# EasyEDA Pro project OMO - WayBox.eprj, board PCB2
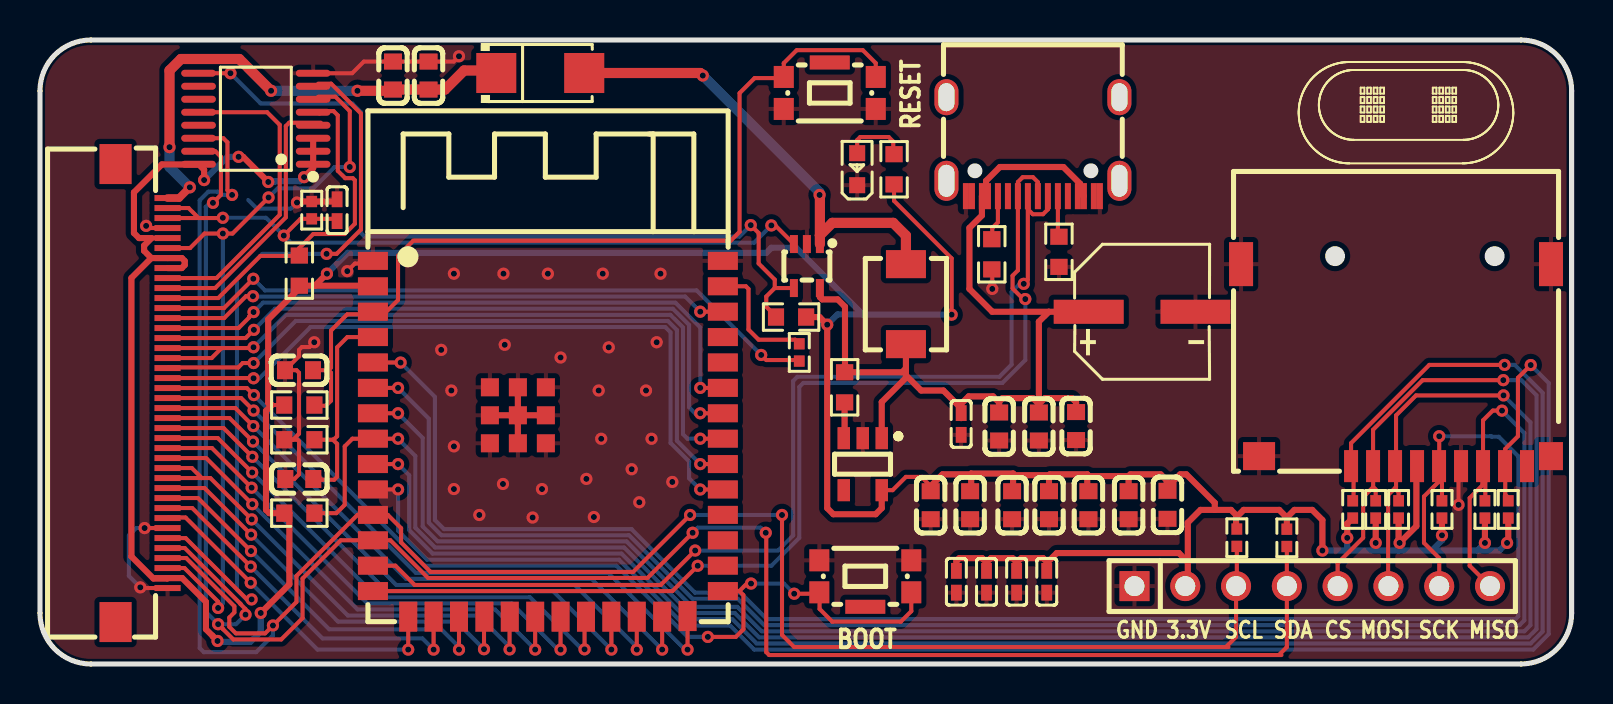
[diagram p4: board, top side]
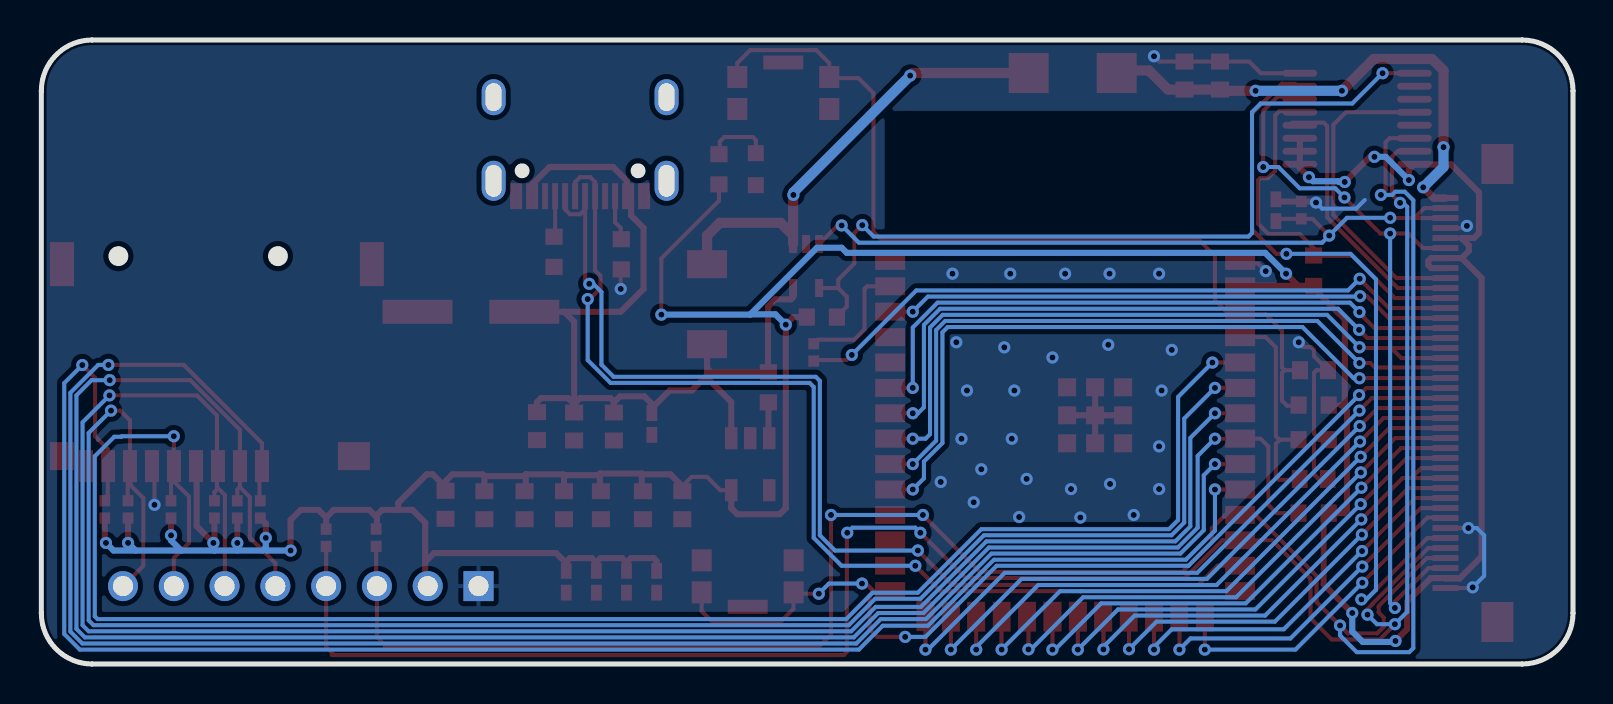
[diagram p5: board, bottom side, seen from below]

Outline 76.6 x 31.2 mm; copper layers: Top Layer, Bottom Layer. Coordinates in mm from the lower left corner of the outline.
Outline path: 0,28.66 0,2.54 arc(0.74,0.74) 2.54,0 74.06,0 arc(75.86,0.74) 76.6,2.54 76.6,28.66 arc(75.86,30.46) 74.06,31.2 2.54,31.2 arc(0.74,30.46) 0,28.66
Stack: Top Layer 0.035mm / Dielectric1 1.51mm FR4 er 4.5 / Bottom Layer 0.035mm

## Design rules (mm)
template: JLCPCB Capability(Two Layers Board)
spacing copperThickness1oz (default): track to track 0.102, other pairs 0.152 to 0.3
spacing copperThickness2oz: track to track 0.203, other pairs 0.152 to 0.3
track width copperThickness1oz (default): min 0.127, default 0.254, max 2.54
track width copperThickness2oz: min 0.203, default 0.254, max 2.54
differential pair differentialPair (default): width min 0.127, default 0.254, max 2.54; gap min 0.152, default 0.152
via viaSize (default): diameter min 0.5, default 0.61, max 10; hole min 0.3, default 0.305, max 6.3

## Placement (name value [footprint] x y rotation side)
C2  220uF  [CAP-SMD_BD6.3-L6.6-W6.6-LS7.2-FD]  55.12 17.61 0 top
C5  100nF  [C0402]  47.34 4.11 270 top
C7  100nF  [C0402]  46.07 12 270 top
C8  1uF  [C0603]  56.39 7.96 270 top
C13  100nF  [C0402]  48.84 4.11 270 top
C14  100nF  [C0402]  50.35 4.11 270 top
C15  100nF  [C0402]  45.83 4.11 270 top
C16  1uF  [C0603]  12.95 14.69 180 top
C17  1uF  [C0603]  12.97 9.25 180 top
C18  10uF  [C0603]  47.97 11.87 270 top
C19  10uF  [C0603]  49.95 11.87 270 top
C20  10uF  [C0603]  52.43 7.94 270 top
C21  10uF  [C0603]  54.44 7.94 270 top
C22  10uF  [C0603]  48.62 7.94 270 top
C23  10uF  [C0603]  50.46 7.94 270 top
C24  10uF  [C0603]  46.52 7.94 270 top
C25  10uF  [C0603]  44.54 7.94 270 top
C26  10uF  [C0603]  51.81 11.9 270 top
C28  1uF  [C0603]  19.43 29.42 90 top
C29  1uF  [C0603]  17.65 29.42 90 top
C30  100nF  [C0402]  14.86 22.69 270 top
D1  SS34  [SMA_L4.3-W2.6-LS5.2-RD]  25.02 29.55 0 top
FPC1  AFC01-S40FCA-00  [FPC-SMD_P0.50-40P_FGS-XJ-H2.0]  5.08 13.55 90 top
H1  PZ254V-11-08P  [HDR-TH_8P-P2.54-V-M]  63.63 3.89 0 top
LED1  KT-0603G  [LED0603-RD]  40.87 24.74 90 top
R1  100kΩ  [R0603]  40.24 13.83 270 top
R4  10kΩ  [R0603]  42.71 24.74 270 top
R5  10kΩ  [R0603]  12.97 12.95 180 top
R6  1MΩ  [R0603]  12.97 11.21 0 top
R7  10kΩ  [R0603]  12.97 19.67 270 top
R8  100Ω  [R0402]  37.97 15.58 270 top
R9  10kΩ  [R0603]  37.56 17.35 0 top
R11  5.1kΩ  [R0603]  47.6 20.49 90 top
R12  5.1kΩ  [R0603]  50.96 20.61 270 top
R13  47kΩ  [R0402]  73.43 7.73 90 top
R14  10kΩ  [R0603]  12.97 7.54 180 top
R15  47kΩ  [R0402]  72.26 7.73 90 top
R16  47kΩ  [R0402]  70.11 7.73 90 top
R17  47kΩ  [R0402]  67.95 7.73 90 top
R18  47kΩ  [R0402]  65.65 7.73 90 top
R19  47kΩ  [R0402]  66.8 7.73 90 top
R20  47kΩ  [R0402]  62.36 6.31 90 top
R21  47kΩ  [R0402]  59.86 6.31 90 top
R22  8.2Ω  [R0402]  13.59 22.69 270 top
SW1  KMR221GLFS  [KEY-SMD_KMR2XXGXXX]  39.5 28.91 0 top
SW2  KMR221GLFS  [KEY-SMD_KMR2XXGXXX]  41.27 4.02 180 top
TF1  TF-CARD H1.8  [TF-SMD_TF-CARD-H1.8]  67.82 14.94 180 top
U1  ESP32-S3-WROOM-1-N16R8  [WIRELM-SMD_ESP32-S3-WROOM-1]  25.4 11.26 0 top
U2  AP2112K-3.3TRG1  [SOT-25-5_L2.9-W1.6-P0.95-LS2.8-BL]  41.15 9.99 180 top
U3  PCA9554PW,118  [TSSOP-16_L5.0-W4.4-P0.65-LS6.4-BL]  10.8 27.26 90 top
U4  TPS61169DCKR  [SC-70-5_L2.1-W1.3-P0.65-LS2.1-BR]  38.35 19.9 90 top
U5  6.8uH  [IND-SMD_L4.5-W4.1_TMPC0412HP]  43.31 17.99 270 top
USBC1  TYPE-C-31-M-12  [USB-C_SMD-TYPE-C-31-M-12]  49.66 25.87 180 top

## Footprints (pads in the part's own frame, mm; a bottom-side part is the same pattern mirrored in y, then rotated)
C0402
  rect 0.79x0.54 smd: 1(-0.545,0) 2(0.545,0)
C0603
  rect 0.8x0.9 smd: 1(-0.7,0) 2(0.7,0)
CAP-SMD_BD6.3-L6.6-W6.6-LS7.2-FD
  rect 3.5x1.2 smd: 1(-2.67,0) 2(2.67,0)
FPC-SMD_P0.50-40P_FGS-XJ-H2.0
  rect 0.3x1.3 smd: 1(9.75,-1.3) 2(9.25,-1.3) 3(8.75,-1.3) 4(8.25,-1.3) 5(7.75,-1.3) 6(7.25,-1.3) 7(6.75,-1.3) 8(6.25,-1.3) 9(5.75,-1.3) 10(5.25,-1.3) 11(4.75,-1.3) 12(4.25,-1.3) 13(3.75,-1.3) 14(3.25,-1.3) 15(2.75,-1.3) 16(2.25,-1.3) 17(1.75,-1.3) 18(1.25,-1.3) 19(0.75,-1.3) 20(0.25,-1.3) 21(-0.25,-1.3) 22(-0.75,-1.3) 23(-1.25,-1.3) 24(-1.75,-1.3) 25(-2.25,-1.3) 26(-2.75,-1.3) 27(-3.25,-1.3) 28(-3.75,-1.3) 29(-4.25,-1.3) 30(-4.75,-1.3) 31(-5.25,-1.3) 32(-5.75,-1.3) 33(-6.25,-1.3) 34(-6.75,-1.3) 35(-7.25,-1.3) 36(-7.75,-1.3) 37(-8.25,-1.3) 38(-8.75,-1.3) 39(-9.25,-1.3) 40(-9.75,-1.3)
  rect 2x1.6 smd: 41(-11.45,1.3) 42(11.45,1.3)
HDR-TH_8P-P2.54-V-M
  rect 1.5x1.5 hole 1: 1(-8.89,0)
  round 1.5 hole 1: 2(-6.35,0) 3(-3.81,0) 4(-1.27,0) 5(1.27,0) 6(3.81,0) 7(6.35,0) 8(8.89,0)
IND-SMD_L4.5-W4.1_TMPC0412HP
  rect 1.4x2 smd: 1(-2,0) 2(2,0)
KEY-SMD_KMR2XXGXXX
  rect 1x1.1 smd: 1(-2.3,0.438) 2(2.3,0.438) 3(-2.3,-1.162) 4(2.3,-1.162)
  rect 2x0.7 smd: 5(0,1.162)
LED0603-RD
  rect 0.8x0.8 smd: 1(-0.799,0) 2(0.799,0)
R0402
  rect 0.566x0.54 smd: 1(-0.433,0) 2(0.433,0)
R0603
  rect 0.806x0.864 smd: 1(-0.753,0) 2(0.753,0)
SC-70-5_L2.1-W1.3-P0.65-LS2.1-BR
  rect 0.9x0.4 smd: 1(1.1,-0.65) 2(1.1,0) 3(1.1,0.65) 4(-1.1,0.65) 5(-1.1,-0.65)
SMA_L4.3-W2.6-LS5.2-RD
  rect 2x2 smd: 1(-2.2,0) 2(2.2,0)
SOT-25-5_L2.9-W1.6-P0.95-LS2.8-BL
  rect 0.623x1.105 smd: 1(-0.95,-1.3) 2(-0.001,-1.3) 3(0.95,-1.3) 4(0.95,1.3) 5(-0.95,1.3)
TF-SMD_TF-CARD-H1.8
  rect 0.7x1.6 smd: 1(2.25,5.05) 2(1.15,5.05) 3(0.05,5.05) 4(-1.05,5.05) 5(-2.15,5.05) 6(-3.25,5.05) 7(-4.35,5.05) 8(-5.45,5.05) 9(-6.55,5.05)
  rect 1.2x1.4 smd: 10(-7.747,4.55)
  rect 1.2x2.2 smd: 11(-7.75,-5.05) 12(7.75,-5.05)
  rect 1.6x1.4 smd: 13(6.85,4.55)
TSSOP-16_L5.0-W4.4-P0.65-LS6.4-BL
  oval 0.343x1.732 smd: 1(-2.275,-2.866) 2(-1.625,-2.866) 3(-0.975,-2.866) 4(-0.325,-2.866) 5(0.325,-2.866) 6(0.975,-2.866) 7(1.625,-2.866) 8(2.275,-2.866) 9(2.275,2.866) 10(1.625,2.866) 11(0.975,2.866) 12(0.325,2.866) 13(-0.325,2.866) 14(-0.975,2.866) 15(-1.625,2.866) 16(-2.275,2.866)
USB-C_SMD-TYPE-C-31-M-12
  oval 1.2x2 hole 0.8x1.6: 0(-4.325,1.706) 1(4.325,1.706)
  oval 1.2x1.8 hole 0.8x1.4: 2(4.325,-2.474) 3(-4.325,-2.474)
  rect 0.3x1.3 smd: A1(-3.35,2.474) A4(-2.55,2.474) A5(-1.25,2.474) A6(-0.25,2.474) A7(0.25,2.474) A8(1.25,2.474) A9(2.55,2.474) A12(3.35,2.474) B1(3.05,2.474) B4(2.25,2.474) B5(1.75,2.474) B6(0.75,2.474) B7(-0.75,2.474) B8(-1.75,2.474) B9(-2.25,2.474) B12(-3.05,2.474)
WIRELM-SMD_ESP32-S3-WROOM-1
  rect 1.5x0.9 smd: 1(-8.75,8.895) 2(-8.75,7.625) 3(-8.75,6.355) 4(-8.75,5.085) 5(-8.75,3.815) 6(-8.75,2.545) 7(-8.75,1.275) 8(-8.75,0.005) 9(-8.75,-1.265) 10(-8.75,-2.535) 11(-8.75,-3.805) 12(-8.75,-5.075) 13(-8.75,-6.345) 14(-8.75,-7.615) 27(8.75,-7.615) 28(8.75,-6.345) 29(8.75,-5.075) 30(8.75,-3.805) 31(8.75,-2.535) 32(8.75,-1.265) 33(8.75,0.005) 34(8.75,1.275) 35(8.75,2.545) 36(8.75,3.815) 37(8.75,5.085) 38(8.75,6.355) 39(8.75,7.625) 40(8.75,8.895)
  rect 0.9x1.5 smd: 15(-6.985,-8.895) 16(-5.715,-8.895) 17(-4.445,-8.895) 18(-3.175,-8.895) 19(-1.905,-8.895) 20(-0.635,-8.895) 21(0.635,-8.895) 22(1.905,-8.895) 23(3.175,-8.895) 24(4.445,-8.895) 25(5.715,-8.895) 26(6.985,-8.865)
  rect 0.9x0.9 smd: 41(-2.9,2.575) 41(-2.9,1.175) 41(-2.9,-0.225) 41(-1.5,2.575) 41(-1.5,1.175) 41(-1.5,-0.225) 41(-0.1,2.575) 41(-0.1,1.175) 41(-0.1,-0.225)

## Nets
As in the schematic.

Pads without a net: FPC1 41 42; SW1 5; SW2 5; TF1 9; U1 28 29 30 36 37; U2 4; U3 10 11 13; USBC1 0 1 2 3 A8 B8

## Via types
v1: diameter 0.61, hole 0.305, Top Layer to Bottom Layer, 135 vias

## Routing (per net, layer and track width the routed paths; a pad name or vN(x,y) marks a point on that pad's centre or on a via; arc(x,y) is an arc through that point)
3V3: length 203.7
  Top Layer w0.203: R4.2 42.71,23.16 45.59,20.28 v1(45.59,17.47) ; 12.34,12.95 11.59,12.95 ; 44.54,8.89 44.08,9.36 43.31,9.36 42.64,8.69 U2.5 ; 5.58,21.3 FPC1.5
  Top Layer w0.305: 59.82,7.32 60.2,7.7 61.98,7.7 62.36,7.32 ; 59.82,7.32 59.82,6.79 R21.2 ; 59.82,7.32 59.82,7.45 59.56,7.7 58.75,7.7 ; 13.75,18.91 v1(14.35,19.52) ; 13.75,18.91 16.62,18.91 U1.2 ; 13.75,18.91 R7.2 12.97,18.79 11.41,17.23 11.41,13.06 11.52,12.95 11.59,12.95 11.3,12.66 11.3,7.7 11.47,7.54 12.47,7.54 12.47,3.98 v1(11.04,2.55) ; R15.1 v1(72.26,6.05) ; R13.1 73.43,6.11 v1(73.37,6.05) ; 46.57,9.52 46.53,9.48 45.14,9.48 44.54,8.89 C25.1 ; 46.57,9.52 48.67,9.52 ; 46.57,9.52 46.57,8.69 C24.1 ; 50.38,5.08 50.85,5.55 56.96,5.55 57.4,5.1 ; 50.38,5.08 50.17,5.29 49.07,5.29 48.86,5.08 ; 50.38,5.08 50.38,4.69 C14.1 ; 68.83,9.86 68.83,6.89 v1(68,6.05) 67.95,6.1 R17.1 ; 68.83,9.86 TF1.4 ; 68.83,9.86 68.83,10.11 ; 68.83,9.86 68.71,9.73 ; R9.2 38.99,17.35 v1(39.37,16.97) 39.37,7.79 39.67,7.49 41.79,7.49 42.1,7.79 U2.5 ; v1(65.38,6.31) 65.38,7.02 R18.1 ; 50.46,9.44 50.5,9.48 52.37,9.48 ; 50.46,9.44 48.75,9.44 48.67,9.52 ; 50.46,9.44 C23.1 ; 5.57,20.3 FPC1.7 7.09,20.3 7.24,20.15 7.24,19.95 7.09,19.8 FPC1.8 ; 5.57,20.3 5.21,20.66 5.21,20.92 5.58,21.3 4.95,21.3 4.7,21.55 4.7,23.58 6.1,24.98 7.84,24.98 ; 5.57,20.3 4.57,19.3 4.57,5.37 5.67,4.28 6.36,4.28 FPC1.39 7.11,4.3 8.3,3.11 8.3,1.74 8.64,1.4 8.64,1.39 v1(8.88,1.15) ; 54.44,9.4 54.53,9.48 56.05,9.48 56.35,9.18 56.35,8.7 C8.1 56.39,8.85 57.02,9.48 57.33,9.48 58.75,8.06 58.75,7.7 ; 54.44,9.4 C21.1 ; 54.44,9.4 52.46,9.4 52.37,9.48 ; 48.86,5.08 48.86,4.67 C13.1 ; 48.86,5.08 48.64,5.29 47.56,5.29 47.34,5.07 ; v1(11.42,24.1) 10.16,25.36 v1(9.93,25.36) ; v1(64.14,5.67) 64.14,7.2 63.63,7.7 62.74,7.7 62.36,7.32 ; 57.4,5.1 57.4,7.07 58.04,7.7 58.75,7.7 ; 57.4,5.1 57.4,3.89 ; v1(8.21,24.2) 8.21,24.71 U3.16 ; 52.37,9.48 52.37,8.7 C20.1 ; 62.36,7.32 R20.2 ; 48.67,9.52 48.67,8.69 C22.1 ; 47.34,5.07 47.12,5.29 45.97,5.29 45.83,5.15 C15.1 ; 47.34,5.07 C5.1 ; R16.1 v1(70.11,6.44) ; v1(13.21,24.34) 13.66,24.8 U3.1 U3.2 U3.3 ; R19.1 v1(66.8,6.05)
  Bottom Layer w0.203: v1(66.8,6.05) 66.82,6.03 66.82,5.67
  Bottom Layer w0.305: v1(68,6.05) 68,5.73 67.94,5.67 ; v1(72.26,6.05) 71.88,5.67 ; 71.88,5.67 69.61,5.67 ; 71.88,5.67 72.99,5.67 v1(73.37,6.05) ; v1(14.35,19.52) 15.39,20.56 36.32,20.56 36.57,20.81 37.81,20.81 41.14,17.48 ; v1(11.04,2.55) 11.04,1.63 10.52,1.1 8.93,1.1 v1(8.88,1.15) ; v1(39.37,16.97) 39.89,17.48 41.14,17.48 ; 65.38,5.83 65.38,5.71 65.34,5.67 v1(64.14,5.67) ; 65.38,5.83 v1(65.38,6.31) ; 65.38,5.83 65.53,5.67 67.94,5.67 ; v1(70.11,6.44) 70.11,6.18 69.61,5.67 ; 67.94,5.67 69.61,5.67 ; 41.14,17.48 41.16,17.47 v1(45.59,17.47) ; v1(8.21,24.2) 9.37,25.36 v1(9.93,25.36) ; v1(13.21,24.34) 13.01,24.14 11.74,24.14 11.7,24.1 v1(11.42,24.1)
+5V: length 48.7
  Top Layer w0.305: 43.31,14.78 43.11,14.59 40.26,14.59 40.26,17.86 39.89,18.23 39.12,18.23 39,18.34 U4.5 ; 43.31,14.78 43.31,14.44 ; 43.31,14.78 U5.2 ; 43.31,14.44 44.07,13.67 45.18,13.67 46.07,12.78 ; 43.31,14.44 43.31,14.31 42.1,13.1 U2.1 ; USBC1.A4 52.02,23.58 52.02,24.01 51.18,24.85 48.01,24.85 47.31,24.16 47.31,23.39 USBC1.A9 47.11,22.43 46.48,21.8 46.48,18.75 47.62,17.61 50.45,17.61 ; 49.95,13 49.95,17.12 50.45,17.61 ; 49.95,13 50.25,13.29 51.61,13.29 51.82,13.09 51.82,12.6 ; 49.95,13 49.66,13.29 48.13,13.29 47.97,13.13 47.97,13.08 ; 49.95,13 C19.1 ; 46.07,12.78 46.07,13.01 46.44,13.38 47.66,13.38 47.97,13.08 ; 46.07,12.78 46.07,12.29 ; 47.97,13.08 C18.1 ; 50.45,17.61 52.19,17.61 52.32,17.74
+24V: length 25.3
  Top Layer w0.381: FPC1.1 6.96,23.3 v1(7.49,23.83)
  Top Layer w0.508: D1.1 22.69,29.68 21.21,29.68 20.25,28.72 C28.1 C29.1 17.59,28.66 v1(15.88,28.66) ; v1(11.56,28.66) 9.97,30.25 7.05,30.25 6.48,29.68 v1(6.48,25.84)
  Bottom Layer w0.508: v1(7.49,23.83) 6.48,24.85 v1(6.48,25.84) ; v1(11.56,28.66) v1(15.88,28.66)
GND: length 40.1
  Top Layer w0.203: v1(5.31,21.91) 5.42,21.8 FPC1.4 ; 12.65,11.21 12.95,11.52 12.95,14.56 12.83,14.69 C16.2 12.95,15.39 12.95,15.71 13.1,15.85 13.48,15.85 v1(13.72,16.09) ; 12.65,11.21 R6.1 ; 12.65,11.21 12.87,11.21 12.95,11.13 12.95,9.48 12.72,9.25 C17.2 ; FPC1.40 5.05,3.8 v1(5.02,3.83) ; v1(70.94,7.96) 70.94,10.02 71.2,10.27 ; v1(47.62,18.75) 47.62,19.71 R11.1 ; 13.66,29.54 15.61,29.54 16.19,30.12 C29.2 C28.2 20.69,30.12 v1(20.95,30.39) ; U1.1 16.52,20.02 15.75,20.02 v1(15.37,19.64) ; FPC1.34 5.33,6.8
  Top Layer w0.305: U1.41 U1.41 ; U1.41 U1.41 ; U1.41 U1.41 ; U1.41 U1.41 ; v1(12.85,23.07) 12.9,23.12 R22.1 14.75,23.12 C30.1
  Bottom Layer w0.203: v1(5.02,3.83) 4.44,4.4 4.44,6.44 4.81,6.8 v1(5.23,6.8) ; 10.41,23.2 10.85,22.77 12.55,22.77 v1(12.85,23.07) ; v1(47.62,18.75) 47.5,18.75
  vias: v1(20.07,15.71) v1(20.57,13.67) v1(20.7,19.52) v1(20.7,10.88) v1(20.7,8.75) v1(21.97,7.45) v1(23.18,19.52) v1(23.15,9) v1(23.24,15.96) v1(24.64,7.32) v1(25.11,8.75) v1(25.4,19.52) v1(26.03,15.33) v1(27.33,9.25) v1(27.7,7.35) v1(27.94,13.67) v1(28.07,11.26) v1(28.14,19.52) v1(28.44,15.83) v1(29.59,9.74) v1(29.97,8.09) v1(30.31,13.67) v1(30.58,11.26) v1(30.84,16.09) v1(31.03,19.52) v1(31.62,9.1)
A0: length 84.6
  Top Layer w0.203: 73.3,9.86 73.28,9.88 ; 73.28,9.88 73.28,10.09 73.43,10.24 ; 73.28,9.88 TF1.8 ; 73.28,9.88 73.28,8.47 73.43,8.32 73.43,8.16 ; 73.28,10.63 73.28,10.75 73.91,11.39 73.91,14.31 v1(74.55,14.95) ; U1.10 v1(17.91,8.73)
  Bottom Layer w0.203: v1(74.55,14.95) 75.45,14.05 75.45,1.5 74.68,0.72 35.71,0.72 34.52,1.91 32.26,1.91 28.96,5.22 19.36,5.22 17.91,6.67 v1(17.91,8.73)
A1: length 90.7
  Top Layer w0.203: U1.9 v1(17.91,10) ; 65.65,8.16 65.7,8.21 65.7,10.27 65.57,10.4 65.57,11.04 69.48,14.95 v1(73.25,14.95)
  Bottom Layer w0.203: v1(73.25,14.95) 73.76,14.95 75.15,13.56 75.15,1.62 74.55,1.02 35.84,1.02 34.62,2.24 32.36,2.24 29.08,5.52 19.63,5.52 18.47,6.69 18.47,9.44 v1(17.91,10)
B1: length 37.1
  Top Layer w0.203: U1.33 v1(33.02,11.27) ; FPC1.17 8.58,15.3 9.08,15.8 ; v1(10.68,15.84) 10.64,15.8 9.08,15.8 ; 9.08,15.8 FPC1.16
  Bottom Layer w0.203: v1(10.68,15.84) 12.3,17.46 31.53,17.46 32.16,16.83 32.16,11.49 32.38,11.27 v1(33.02,11.27)
B2: length 35
  Top Layer w0.203: FPC1.18 6.41,14.83 9.92,14.83 10.14,15.05 v1(10.68,15.05) ; U1.32 v1(33.02,10)
  Bottom Layer w0.203: v1(10.68,15.05) 12.79,17.15 31.4,17.15 31.85,16.7 31.85,11.16 v1(33.02,10)
B3: length 35.9
  Top Layer w0.203: U1.31 v1(33.02,8.73) ; FPC1.19 10.67,14.3 v1(10.68,14.29)
  Bottom Layer w0.203: v1(10.68,14.29) 10.97,14.29 13.53,16.85 31.27,16.85 31.53,16.58 31.53,11.05 32.46,10.12 32.46,9.28 v1(33.02,8.73)
B5: length 32.9
  Top Layer w0.203: U1.26 v1(32.39,0.72) ; FPC1.21 10.06,13.3 v1(10.68,12.67)
  Bottom Layer w0.203: v1(10.68,12.67) 18.8,4.56 28.42,4.56 32.26,0.72 v1(32.39,0.72)
BACKLIGHT: length 41.4
  Top Layer w0.203: 36.75,18.8 36.32,18.37 36.32,17.86 36.83,17.36 37.05,17.36 37.06,17.35 ; 36.75,18.8 36.75,19.22 35.94,20.02 35.94,21.55 v1(35.55,21.94) ; 36.75,18.8 U4.4 ; 7.93,29.54 v1(9.52,29.54)
  Bottom Layer w0.203: v1(35.55,21.94) 34.97,21.37 16.23,21.37 16.05,21.55 16.05,27.59 15.62,28.02 11.04,28.02 v1(9.52,29.54)
BOOT: length 48.2
  Top Layer w0.203: v1(10.7,13.45) 10.35,13.8 FPC1.20 ; 34.98,3.65 35.18,3.44 35.18,1.74 34.8,1.36 v1(33.4,1.36) ; 34.98,3.65 35.35,4.02 v1(35.56,4.02) ; 34.98,3.65 U1.27 ; 43.58,3.58 43.58,2.64 43.05,2.12 39.62,2.12 38.99,2.75 38.99,3.57 38.98,3.58 38.9,3.51 v1(37.72,3.51)
  Bottom Layer w0.203: v1(33.4,1.36) 32.39,1.36 28.83,4.91 19.23,4.91 v1(10.7,13.45) ; v1(35.56,4.02) 37.21,4.02 v1(37.72,3.51)
CS: length 102
  Top Layer w0.203: 66.67,8.85 66.67,8.85 66.17,8.35 66.17,6.31 64.9,5.04 H1.5 ; 66.67,8.85 66.67,9.18 ; 66.67,8.85 66.8,8.72 66.8,8.16 ; v1(17.91,11.27) U1.8 15.63,11.27 15.24,10.88 15.24,7.96 14.82,7.54 13.72,7.54 ; 66.67,9.18 66.67,9.89 TF1.2 ; 66.67,9.18 66.67,9.18 TF1.2 ; v1(73.18,14.19) 69.15,14.19 66.67,11.71 TF1.2
  Bottom Layer w0.203: v1(17.91,11.27) 18.77,10.4 18.77,6.82 19.76,5.83 29.21,5.83 32.49,2.55 34.75,2.55 35.97,1.33 74.42,1.33 74.84,1.75 74.84,13.43 74.09,14.19 v1(73.18,14.19)
D+: length 53.1
  Top Layer w0.203: USBC1.A6 49.91,24.09 49.66,24.34 49.15,24.34 48.91,24.1 USBC1.B6 48.91,19.68 48.64,19.42 48.64,18.78 49.17,18.25 v1(49.28,18.25) ; U1.14 31.63,3.65 v1(32.89,4.91)
  Bottom Layer w0.203: v1(32.89,4.91) 36.58,4.91 37.97,6.31 37.97,13.85 38.18,14.05 48.13,14.05 49.28,15.2 v1(49.28,18.25)
D-: length 52.8
  Top Layer w0.203: v1(32.77,5.67) 31.04,3.95 18.74,3.95 17.77,4.92 U1.13 ; v1(49.2,19.01) 49.4,19.21 49.4,23.39 USBC1.A7 49.41,22.73 49.65,22.49 50.16,22.49 50.41,22.73 USBC1.B7
  Bottom Layer w0.203: v1(49.2,19.01) 48.99,19.01 48.59,18.6 48.59,14.97 47.98,14.36 37.87,14.36 37.67,14.16 37.67,6.43 36.91,5.67 v1(32.77,5.67)
DBLTAP: length 10.4
  Top Layer w0.203: 13.92,9.38 14.09,9.21 14.72,9.21 14.86,9.36 14.86,11.01 14.65,11.21 ; 14.65,11.21 14.68,11.21 14.86,11.39 14.86,15.83 15.37,16.35 U1.4 ; 14.65,11.21 13.98,11.21
DE: length 28.5
  Top Layer w0.203: FPC1.13 9.21,17.3 10.3,18.39 v1(10.65,18.39) ; U1.38 v1(33.02,17.62)
  Bottom Layer w0.203: v1(10.65,18.39) 10.67,18.37 32.26,18.37 v1(33.02,17.62)
G0: length 31.4
  Top Layer w0.203: v1(10.67,11.9) 9.77,12.8 FPC1.22 ; U1.25 v1(31.11,0.72)
  Bottom Layer w0.203: v1(10.67,11.9) 18.31,4.25 27.58,4.25 v1(31.11,0.72)
G1: length 30
  Top Layer w0.203: U1.24 v1(29.85,0.72) ; FPC1.23 9.48,12.3 v1(10.65,11.12)
  Bottom Layer w0.203: v1(10.65,11.12) 17.83,3.95 26.75,3.95 29.85,0.85 v1(29.85,0.72)
G2: length 28.4
  Top Layer w0.203: FPC1.24 9.18,11.8 v1(10.62,10.36) ; 28.58,2.36 v1(28.58,0.72)
  Bottom Layer w0.203: v1(28.58,0.72) 25.66,3.64 24.63,3.64 24.63,3.64 17.34,3.64 v1(10.62,10.36)
G3: length 26.9
  Top Layer w0.203: U1.22 27.23,2.3 v1(27.23,0.73) ; v1(10.61,9.58) 8.89,11.3 FPC1.25
  Bottom Layer w0.203: v1(10.61,9.58) 16.85,3.34 24.5,3.34 27.11,0.73 v1(27.23,0.73)
G4: length 25.5
  Top Layer w0.203: U1.21 v1(26.03,0.72) ; v1(10.58,8.81) 8.6,10.8 FPC1.26
  Bottom Layer w0.203: v1(10.58,8.81) 16.37,3.03 23.6,3.03 25.91,0.72 v1(26.03,0.72)
G5: length 24
  Top Layer w0.203: FPC1.27 8.31,10.3 v1(10.62,7.99) ; U1.20 v1(24.77,0.72)
  Bottom Layer w0.203: v1(10.62,7.99) 15.88,2.73 22.76,2.73 v1(24.77,0.72)
HSYNC: length 33
  Top Layer w0.203: U1.34 v1(33.02,12.54) ; FPC1.15 10.29,16.3 v1(10.7,16.71)
  Bottom Layer w0.203: v1(33.02,12.54) 32.76,12.54 32.46,12.84 32.46,16.95 31.65,17.76 11.75,17.76 v1(10.7,16.71)
LEDK: length 37.4
  Top Layer w0.203: C30.2 14.75,22.26 R22.2 13.03,22.26 v1(12.19,21.42) ; v1(9.14,22.31) 9.13,22.3 7.93,22.3 ; 7.93,22.3 7.43,22.8 FPC1.2 ; 7.93,22.3 FPC1.3 ; U4.3 36.77,21.93 v1(36.58,21.93)
  Bottom Layer w0.203: v1(9.14,22.31) 11.3,22.31 v1(12.19,21.42) 12.55,21.07 35.71,21.07 v1(36.58,21.93)
MISO: length 87.9
  Top Layer w0.203: v1(73.12,12.67) 72.65,12.67 72.17,12.18 TF1.7 72.14,9.86 72.14,8.93 71.5,8.3 71.5,4.91 H1.8 ; 72.26,8.16 72.28,8.18 72.28,9.3 72.26,9.32 ; U1.6 v1(17.91,13.81)
  Bottom Layer w0.203: v1(17.91,13.81) 19.44,12.27 19.44,7.07 20.08,6.44 29.46,6.44 32.64,3.26 34.9,3.26 36.22,1.94 73.99,1.94 74.23,2.18 74.23,11.55 v1(73.12,12.67)
MOSI: length 92.4
  Top Layer w0.203: 67.82,9.94 67.82,12.43 68.82,13.43 v1(73.19,13.43) ; 67.8,8.83 67.42,8.45 67.42,3.91 H1.6 ; 67.8,8.83 67.82,8.85 67.82,9.94 ; 67.8,8.83 67.8,8.74 67.95,8.59 67.95,8.16 ; U1.7 v1(17.91,12.54)
  Bottom Layer w0.203: v1(17.91,12.54) 19.14,11.3 19.14,6.88 19.89,6.13 29.33,6.13 32.61,2.85 34.88,2.85 36.09,1.64 74.24,1.64 74.54,1.94 74.54,12.08 v1(73.19,13.43)
PCLK: length 6.2
  Top Layer w0.203: R8.1 37.77,16.21 35.94,16.21 35.43,16.72 35.43,18.75 35.3,18.89 U1.39
R1: length 24.3
  Top Layer w0.203: FPC1.28 7.59,9.8 8.09,9.3 ; FPC1.29 8.09,9.3 ; 8.09,9.3 8.52,9.3 v1(10.59,7.23) ; U1.19 23.48,2.36 v1(23.48,0.73)
  Bottom Layer w0.203: v1(23.48,0.73) 23.48,0.86 21.92,2.42 15.4,2.42 v1(10.59,7.23)
R2: length 20.8
  Top Layer w0.203: v1(10.56,6.47) 8.23,8.8 FPC1.30 ; 22.23,2.37 22.21,2.35 v1(22.21,0.74)
  Bottom Layer w0.203: v1(22.21,0.74) 20.83,2.12 14.91,2.12 v1(10.56,6.47)
R3: length 19.4
  Top Layer w0.203: FPC1.31 7.9,8.3 v1(10.55,5.65) ; U1.17 v1(20.95,0.72)
  Bottom Layer w0.203: v1(20.95,0.72) 20.95,0.85 20.07,1.74 14.46,1.74 v1(10.55,5.65)
R4: length 17.9
  Top Layer w0.203: v1(10.54,4.87) 7.61,7.8 FPC1.32 ; U1.16 v1(19.68,0.72)
  Bottom Layer w0.203: v1(19.68,0.72) 19.13,1.28 14.13,1.28 v1(10.54,4.87)
R5: length 15.7
  Top Layer w0.203: v1(10.54,4.06) 7.28,7.32 6.41,7.32 FPC1.33 ; 18.42,1.73 18.42,0.86
  Bottom Layer w0.203: v1(18.42,0.72) 13.88,0.72 v1(10.54,4.06)
RESET: length 45.3
  Top Layer w0.203: 14.43,14.69 14.55,14.56 14.55,13.17 14.3,12.91 13.76,12.91 13.72,12.95 ; 14.43,14.69 14.55,14.82 14.55,16.67 15.37,17.48 16.52,17.48 U1.3 16.84,17.42 17.13,17.42 17.91,18.2 17.91,20.41 18.67,21.17 34.54,21.17 34.99,21.61 34.99,28.54 35.74,29.3 37.2,29.3 37.2,30.04 37.85,30.69 41.15,30.69 41.8,30.04 SW1.2 ; 14.43,14.69 C16.1
SCK: length 87.7
  Top Layer w0.203: 69.99,9.15 70.11,9.02 70.11,8.16 ; 69.99,9.15 69.99,9.87 TF1.5 69.98,9.9 v1(69.98,11.39) ; 69.99,9.15 69.21,8.38 69.21,6.05 69.98,5.29 H1.7 ; U1.5 17.91,15.08
  Bottom Layer w0.203: v1(18.03,15.07) 19.75,13.36 19.75,7.2 20.2,6.74 29.59,6.74 32.76,3.56 35.03,3.56 36.35,2.25 73.79,2.25 73.93,2.39 73.93,10.39 72.95,11.36 72.6,11.36 72.57,11.39 v1(69.98,11.39)
SCL: length 106.2
  Top Layer w0.203: FPC1.37 7.31,5.3 9.72,2.89 9.72,2.58 9.47,2.32 9.47,1.86 9.8,1.53 11.26,1.53 v1(11.65,1.93) 12.83,3.1 12.83,4.4 15.88,7.46 17.39,7.46 18.06,6.79 18.06,6.08 19.53,4.61 29.67,4.61 v1(32.51,7.45) ; 59.31,0.85 37.72,0.85 37.11,1.46 v1(37.11,7.45) ; 59.31,0.85 59.44,0.85 ; 59.31,0.85 59.82,1.36 H1.3 59.86,3.93 R21.1 ; U3.14 9.17,26.29 9.37,26.08 9.37,23.69 v1(9.61,23.45)
  Bottom Layer w0.203: v1(9.61,23.45) 9.04,23.45 8.88,23.62 8.42,23.62 7.99,23.18 7.99,0.8 8.19,0.59 10.81,0.59 11.65,1.43 v1(11.65,1.93) ; v1(32.51,7.45) v1(37.11,7.45)
SDA: length 102.5
  Top Layer w0.203: v1(36.3,6.56) 36.32,6.54 36.32,0.59 36.47,0.45 61.96,0.45 ; U3.15 8.77,25.64 9.05,25.36 9.05,23.46 v1(8.65,23.06) ; v1(10.28,2.47) 10.28,2.74 10.03,3 10.03,3.01 7.24,5.8 FPC1.36 ; 61.96,0.45 62.09,0.45 ; 61.96,0.45 62.36,0.85 H1.4 R20.1 ; v1(8.91,1.99) 9.16,1.74 9.16,1.74 9.67,1.23 12.06,1.23 13.13,2.3 13.13,4.28 15.04,6.19 U1.12 17.52,6.19 19.41,4.3 30.38,4.3 v1(32.64,6.56)
  Bottom Layer w0.203: v1(10.28,2.47) 9.8,1.99 v1(8.91,1.99) 8.29,2.61 8.29,22.86 8.49,23.06 v1(8.65,23.06) ; v1(36.3,6.56) 36.04,6.82 32.89,6.82 v1(32.64,6.56)
TFT_CS: length 18.2
  Top Layer w0.203: FPC1.11 8.91,18.3 11.02,20.41 12.95,20.41 12.95,20.79 13.67,21.5 15.23,21.5 15.75,22.01 15.75,24.19 15.64,24.29 15.26,24.29 14.89,24.66 14.89,27.43 14.68,27.64 14.1,27.64 13.97,27.52
TFT_MOSI: length 15.7
  Top Layer w0.203: FPC1.9 8.83,19.3 11.99,22.46 11.99,26.96 11.36,27.59 U3.12
TFT_RESET: length 37.8
  Top Layer w0.203: v1(15.49,24.85) 15.49,27.64 14.77,28.36 13.91,28.36 ; FPC1.38 7.23,4.8 8.91,3.11 v1(8.91,2.8) ; v1(11.43,23.33) 9.63,21.52 v1(9.15,21.52) 8.23,21.52 7.5,20.8 FPC1.6
  Bottom Layer w0.203: v1(8.91,2.8) 9.15,3.04 v1(9.15,21.52) ; v1(11.43,23.33) 11.89,23.78 13.67,23.78 14.73,24.85 v1(15.49,24.85)
TFT_SCK: length 13.8
  Top Layer w0.203: 14.04,27.06 12.46,27.06 12.29,26.9 12.29,22.33 8.76,18.8 FPC1.10
TP_IRQ: length 37.7
  Top Layer w0.203: v1(10.58,3.23) 10.35,3.23 7.29,6.29 6.38,6.29 ; v1(14.33,20.51) 14.83,20.51 16.05,21.73 16.05,27.52 14.56,29.02 13.91,29.02
  Bottom Layer w0.203: v1(14.33,20.51) 11.12,20.51 9.85,19.24 9.85,3.7 10.33,3.23 v1(10.58,3.23)
VSYNC: length 31.9
  Top Layer w0.203: FPC1.14 9.93,16.8 10.46,17.33 10.46,17.38 v1(10.68,17.6) ; U1.35 v1(33.02,13.81)
  Bottom Layer w0.203: v1(10.68,17.6) 11.15,18.07 31.78,18.07 33.02,16.83 v1(33.02,13.81)
$1N9703: length 1.8
  Top Layer w0.305: U2.3 40.24,11.33 R1.2
$1N9711: length 3.3
  Top Layer w0.203: 40.87,25.54 40.87,26.2 41.02,26.35 42.44,26.35 42.67,26.12 42.67,25.53 R4.1
$1N9744: length 33.6
  Top Layer w0.203: 37.7,15.2 36.32,15.2 v1(36.07,15.45) ; FPC1.12 9.2,17.8 v1(10.67,19.26)
  Bottom Layer w0.203: v1(10.67,19.26) 11.25,18.68 32.84,18.68 v1(36.07,15.45)
$1N9806: length 23.1
  Top Layer w0.508: v1(33.15,29.42) 33.02,29.55 D1.2 ; 39,21.44 39.62,22.06 42.67,22.06 43.31,21.42 U5.1 ; 39,21.44 U4.1 ; 39,21.44 39,23.44 v1(38.99,23.45)
  Bottom Layer w0.508: v1(38.99,23.45) 38.99,23.58 v1(33.15,29.42)
$1N9898: length 2.2
  Top Layer w0.203: USBC1.B5 47.91,22.08 47.62,21.8 47.62,21.39 47.6,21.37
$1N9904: length 2.1
  Top Layer w0.203: R12.1 50.91,21.41 USBC1.A5

## Copper pours and planes (outline as drawn; the poured copper is in the pictures)
GND on Top Layer: -1.02,32.72 77.22,32.72 77.22,-1.31 -1.02,-1.31
GND on Bottom Layer: -0.76,32.85 77.47,32.85 77.47,-1.19 -0.76,-1.19

## Text on the board
Top Silkscreen Layer: GND | 3.3V | SCL | SDA | CS | MOSI | SCK | MISO | BOOT | RESET
